# EAGLE design osborne1 (EAGLE 9.6.2)
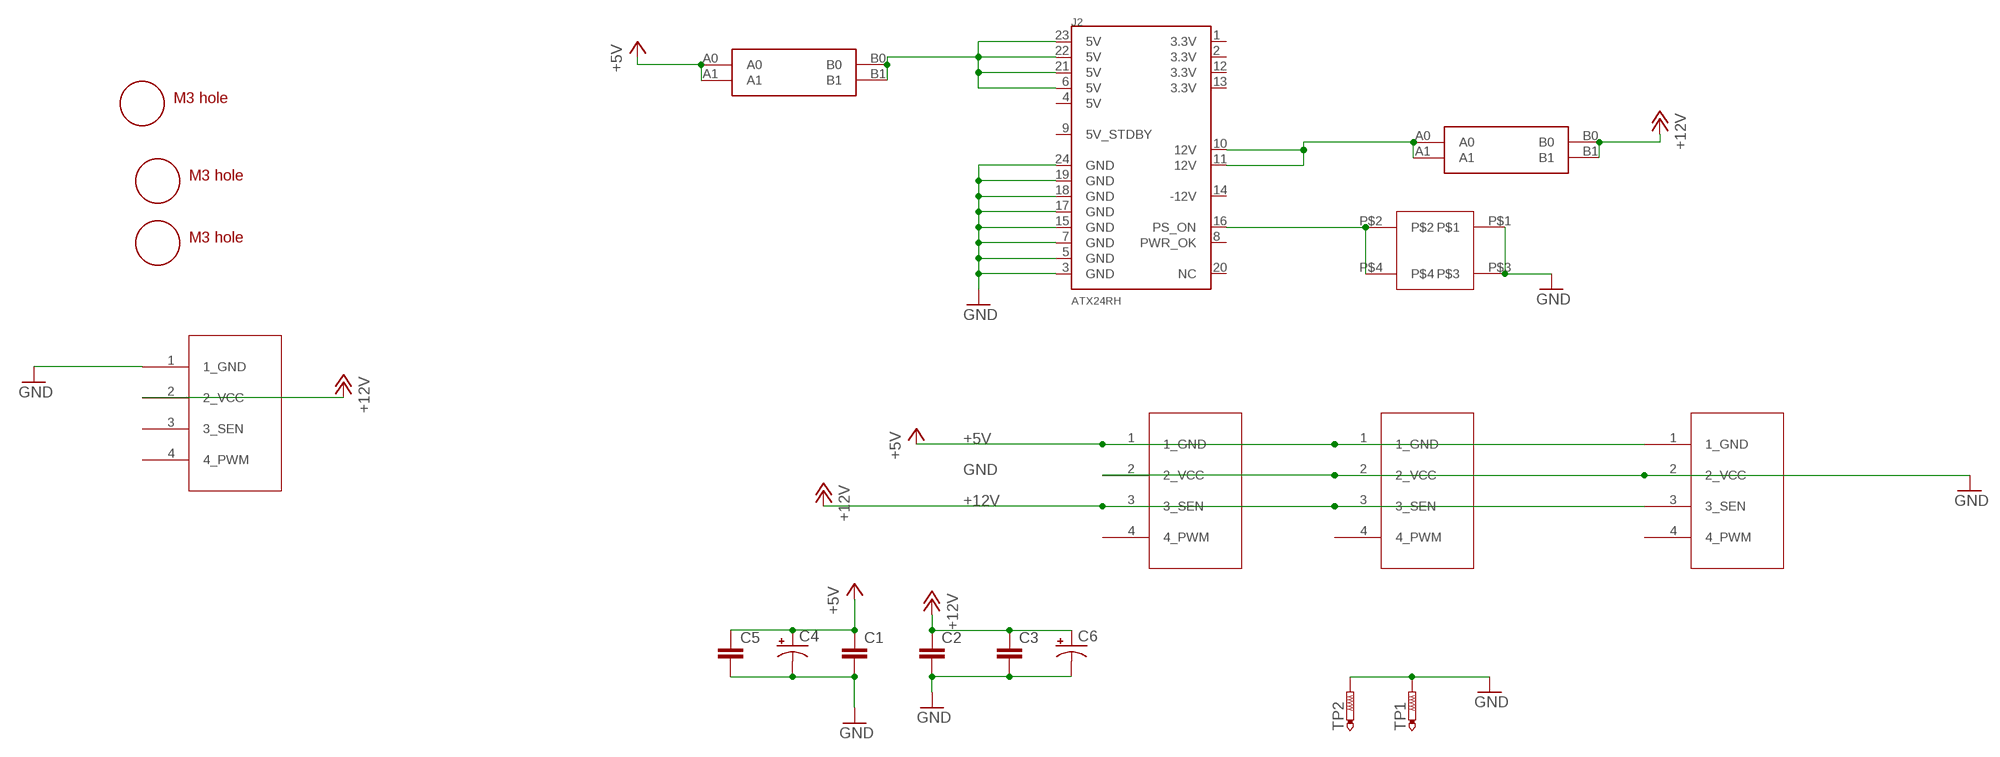
[diagram p0: schematic, sheet 1]

## Parts
C1  C5/2.5  [C5B2.5]
C2  C5/2.5  [C5B2.5]
C3  C5/2.5  [C5B2.5]
C4  CPOL-USE3.5-8  [E3,5-8]
C5  C5/2.5  [C5B2.5]
C6  CPOL-USE3.5-8  [E3,5-8]
J2  ATX24RH  [ATX24_RIGHT_ANGLE]
JP1  4PIN_FAN  [1X04]
JP2  4PIN_FAN  [1X04]
JP3  4PIN_FAN  [1X04]
JP5  4PIN_FAN  [1X04]
TP1  PTR1PAD1-17  [P1-17]
TP2  PTR1PAD1-17  [P1-17]
U$1  M3_MOUNTING_HOLE  [M3_MOUNTING_HOLE_PACK]
U$2  CAR_FUSE_HOLDER3IN1  [FUSE_HOLDER_3IN1]
U$3  M3_MOUNTING_HOLE  [M3_MOUNTING_HOLE_PACK]
U$4  ROCK_SWRSW_VERTICAL  [ROCK_SWITCH_VERTICAL]
U$5  M3_MOUNTING_HOLE  [M3_MOUNTING_HOLE_PACK]
U$8  CAR_FUSE_HOLDER3IN1  [FUSE_HOLDER_3IN1]

## Nets
+5V: C1.1 C4.+ C5.1 JP1.1(1_GND) JP2.1(1_GND) JP5.1(1_GND) U$8.A0 U$8.A1
+12V: C2.1 C3.1 C6.+ JP1.3(3_SEN) JP2.3(3_SEN) JP3.2(2_VCC) JP5.3(3_SEN) U$2.B0 U$2.B1
GND: C1.2 C2.2 C3.2 C4.- C5.2 C6.- J2.3(GND) J2.5(GND) J2.7(GND) J2.15(GND) J2.17(GND) J2.18(GND) J2.19(GND) J2.24(GND) JP1.2(2_VCC) JP2.2(2_VCC) JP3.1(1_GND) JP5.2(2_VCC) TP1.TP TP2.TP U$4.P$1 U$4.P$3
N$1: J2.16(PS_ON) U$4.P$2 U$4.P$4
N$6: J2.6(5V) J2.21(5V) J2.22(5V) J2.23(5V) U$8.B0 U$8.B1
N$8: J2.10(12V) J2.11(12V) U$2.A0 U$2.A1
Unconnected: J2.1(3.3V) J2.2(3.3V) J2.4(5V) J2.8(PWR_OK) J2.9(5V_STDBY) J2.12(3.3V) J2.13(3.3V) J2.14(-12V) J2.20(NC) JP1.4(4_PWM) JP2.4(4_PWM) JP3.3(3_SEN) JP3.4(4_PWM) JP5.4(4_PWM)

## Library data of the parts
C1-C3 C5 = capacitor-wima:C: CAPACITOR naming: grid - package width
C4 C6 = adafruit_changed:CPOL-US: POLARIZED CAPACITOR, American symbol
J2 = macse:ATX24: ATX24 Pin Power Supply Connector This is a good connector for connecting a computer power supply to a PCB. It's massive, but provides many amps of power at 5V and 12V. SKU: PRT-09498
JP1-JP3 JP5 = appleii:4PIN_FAN: PIN HEADER
TP1 TP2 = testpad:PTR1: TEST PIN
U$1 U$3 U$5 = a:M3_MOUNTING_HOLE
U$2 U$8 = atx_power_control:CAR_FUSE_HOLDER
U$4 = atx4vc:ROCK_SW

## Board
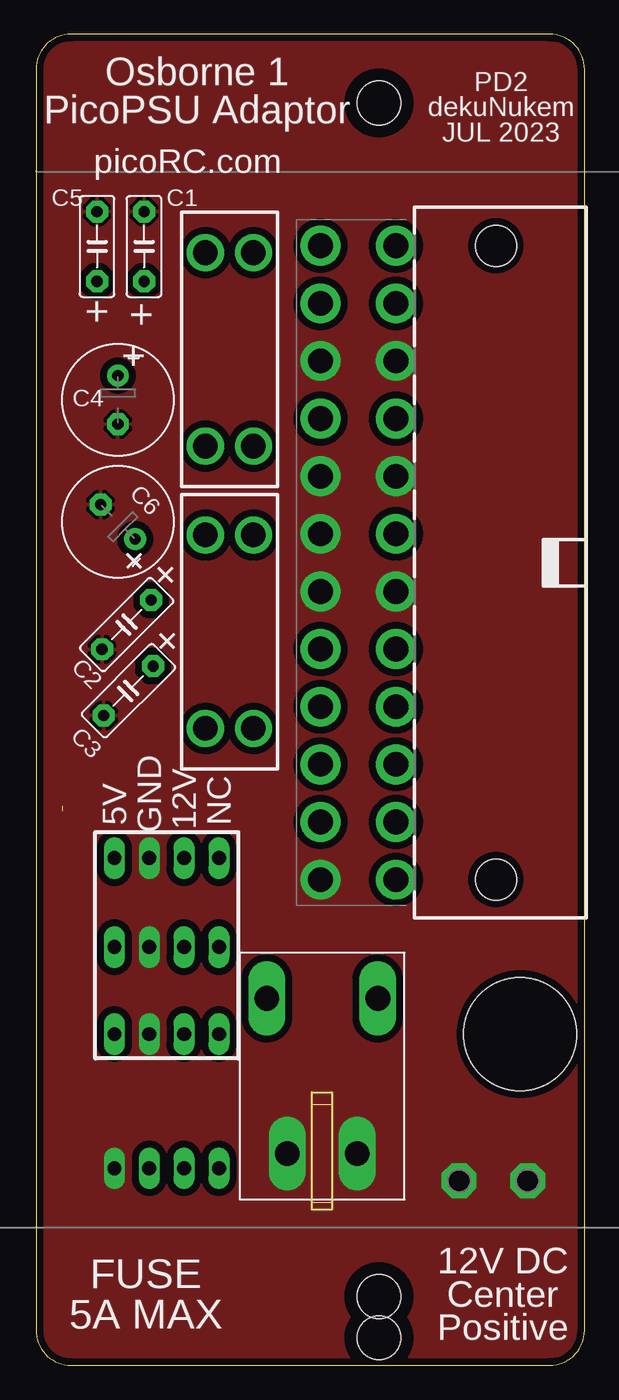
[diagram p1: board, top side]
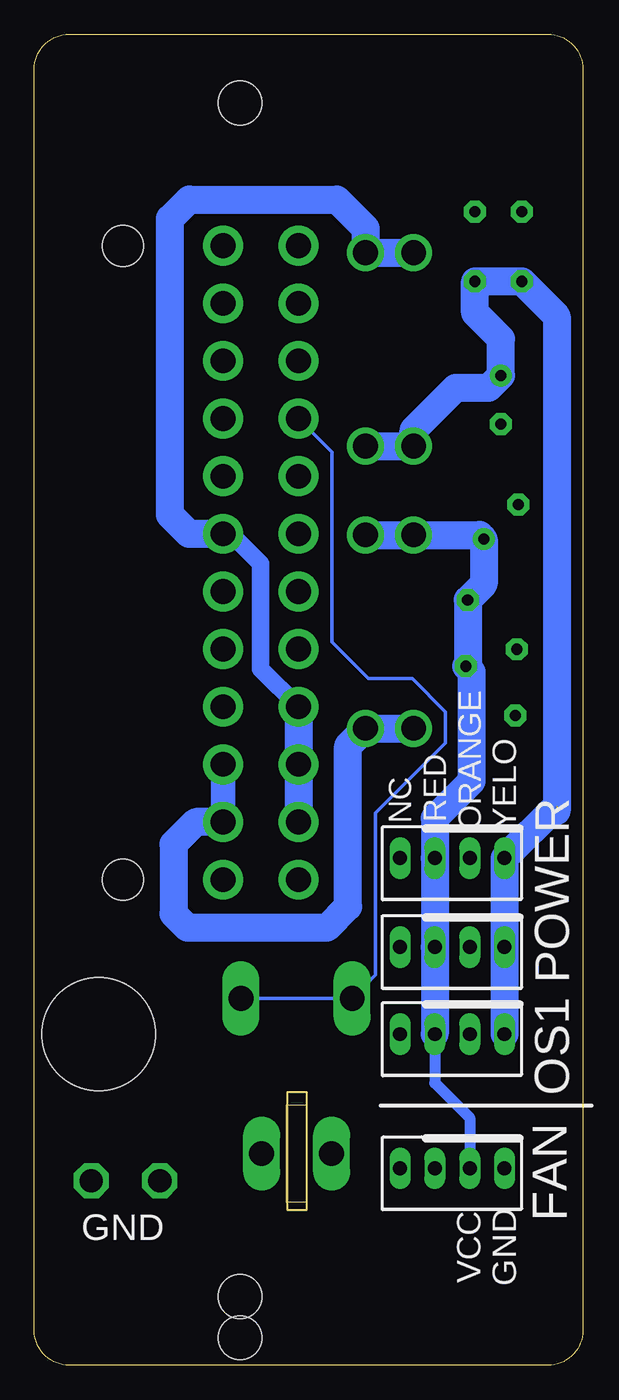
[diagram p2: board, bottom side, seen from below]

Size 40 x 97 mm. Coordinates in mm from the lower left corner, seen from the top.
Outline: 2.54,0 37.46,0 arc90 40,2.54 40,94.46 arc90 37.46,97 2.54,97 arc90 0,94.46 0,2.54 arc90 2.54,0
Copper layers (1*16): Top 0.035mm / dielectric 1.5mm / Bottom 0.035mm
Design rules "deku_2layer_6mil *": minimum track width 6mil, minimum drill 15mil, track to track 20mil, track to pad 6mil, pad to pad 6mil, via to via 6mil, smd to smd 6mil, copper to edge 10mil, drill to drill 6mil, minimum pad ring 7mil, minimum via ring 7mil, stop-mask expansion 4mil, vias tented up to drill 25mil, thermal gap 10mil
Holes 8.25 mm at 35.31,24.13
Milling: area 20.1,11.3 to 21.6,19.9

### Footprints (pad centres in the part's own frame; a part is rotated, then mirrored left to right if it is on the bottom)
C5B2.5 = drill 0.813 pad 1.6 octagon: 1 -2.54,0; 2 2.54,0
E3,5-8 = drill 0.813 pad 1.6: + -1.778,0 | drill 0.813 pad 1.6 octagon: - 1.778,0
ATX24_RIGHT_ANGLE = drill 1.8 pad 2.9: 1 23.1,4.76; 2 18.9,4.76; 3 14.7,4.76; 4 10.5,4.76; 5 6.3,4.76; 6 2.1,4.76; 7 -2.1,4.76; 8 -6.3,4.76; 9 -10.5,4.76; 10 -14.7,4.76; 11 -18.9,4.76; 12 -23.1,4.76; 13 23.1,10.26; 14 18.9,10.26; 15 14.7,10.26; 16 10.5,10.26; 17 6.3,10.26; 18 2.1,10.26; 19 -2.1,10.26; 20 -6.3,10.26; 21 -10.5,10.26; 22 -14.7,10.26; 23 -18.9,10.26; 24 -23.1,10.26 | hole 3: -23.1,-2.54; 23.1,-2.54
1X04 = drill 1.016 long: 1 -3.81,0; 2 -1.27,0; 3 1.27,0; 4 3.81,0
P1-17 = drill 1.702 pad 2.54 octagon: TP 0,0
M3_MOUNTING_HOLE_PACK = hole 3.2: 0,0
FUSE_HOLDER_3IN1 = drill 1.8: A0 -7.05,1.75; A1 -7.05,-1.75; B0 7.05,1.75; B1 7.05,-1.75
ROCK_SWITCH_VERTICAL = drill 1.8 long: P$1 -5.65,-2.55; P$2 5.65,-4.05; P$3 -5.65,2.55; P$4 5.65,4.05

### Placement (x,y rotation side)
C1  7.87,81.53 90 top
C2  6.6,53.98 225 top
C3  6.73,49.15 225 top
C4  5.97,70.36 270 top
C5  4.45,81.53 90 top
C6  5.97,61.47 135 top
J2  31,58.49 90 top
JP1  9.53,24.13 180 bottom
JP2  9.53,30.48 180 bottom
JP3  9.53,14.35 180 bottom
JP5  9.53,36.96 180 bottom
TP1  30.85,13.44 90 top
TP2  35.85,13.44 90 top
U$1  25,92 0 top
U$2  14.1,53.47 90 top
U$3  25,5 0 top
U$4  20.88,21.08 90 top
U$5  25,2 0 top
U$8  14.1,74.04 90 top

### Tracks (layer width: path | path; a pad name or v marks a point on that pad's centre or on a via)
+5V  (1 unrouted)
  Bottom 1.016: JP1.1 5.73,24.12
  Bottom 2.032: U$8.A1 U$8.A0 12.35,68.17 9.27,71.25 6.86,71.25 C4.+ 5.97,74.8 7.87,76.71 C1.1 C5.1 1.91,76.45 1.91,40.39 | 1.91,40.77 JP5.1 JP2.1 JP1.1
+12V
  Bottom 0.813: JP1.3 10.79,20.57 8.26,18.03 JP3.2
  Bottom 2.032: U$2.B1 U$2.B0 7.53,60.52 C6.+ 7.23,56.95 C2.1 8.4,51.07 C3.1 8.13,50.55 8.13,42.55 10.79,39.88 JP5.3 JP2.3 JP1.3
GND
  pour Top (isolate 0.508): 40,97 0,97 0,-0.06 40,-0.06
  pour Top (no thermals): 29.34,15.49 37.34,15.49 37.34,11.43 29.34,11.43
  pour Top (no thermals): 16.51,18.54 25.4,18.54 25.4,12.45 16.51,12.45
N$1
  Bottom 0.254: J2.16 18.29,66.54 18.29,52.7 15.62,50.04 12.45,50.04 10.03,47.62 10.03,45.34 15.11,40.26 15.11,28.45 U$4.P$4 U$4.P$2
N$6
  Bottom 1.27: J2.21 23.5,50.75 23.5,58.42 25.67,60.59 J2.6
  Bottom 2.032: J2.21 J2.22 J2.23 | J2.6 28.71,60.59 30.1,61.98 30.1,83.57 28.7,84.96 17.94,84.96 15.85,82.87 U$8.B1 U$8.B0
N$8
  Bottom 1.778: J2.10 J2.11
  Bottom 2.032: J2.11 28.23,39.59 29.84,37.97 29.84,32.89 28.83,31.88 18.67,31.88 17.12,33.43 17.12,45.15 U$2.A1 U$2.A0

### Text on the board
tNames: Osborne 1 / PicoPSU Adaptor | PD2 / dekuNukem / JUL 2023 | picoRC.com | + | + | + | + | + | + | + | GND | 5V | 12V | NC | FUSE / 5A MAX | 12V DC / Center / Positive
bNames: ORANGE | YELO | RED | NC | OS1 POWER | FAN | GND | GND | VCC